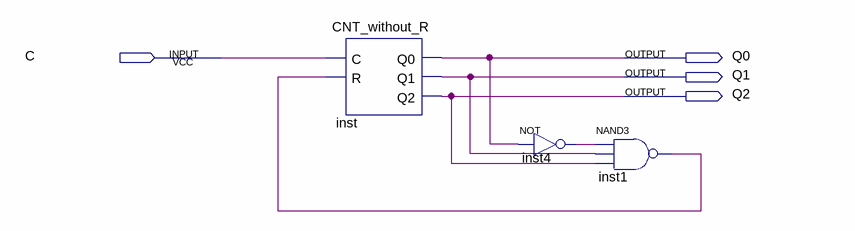
[diagram p0: schematic sheet]
// Quartus schematic CNT.bdf as structural Verilog: 3 symbols, 4 pins
module CNT (
  input  C,
  output Q0,
  output Q1,
  output Q2
);

  wire inst1_out, inst4_out;

  CNT_without_R inst (.C(C), .R(inst1_out), .Q0(Q0), .Q1(Q1), .Q2(Q2));
  not inst4 (inst4_out, Q0);
  nand inst1 (inst1_out, inst4_out, Q1, Q2);
endmodule
